# Altium project picoep.PrjPcb
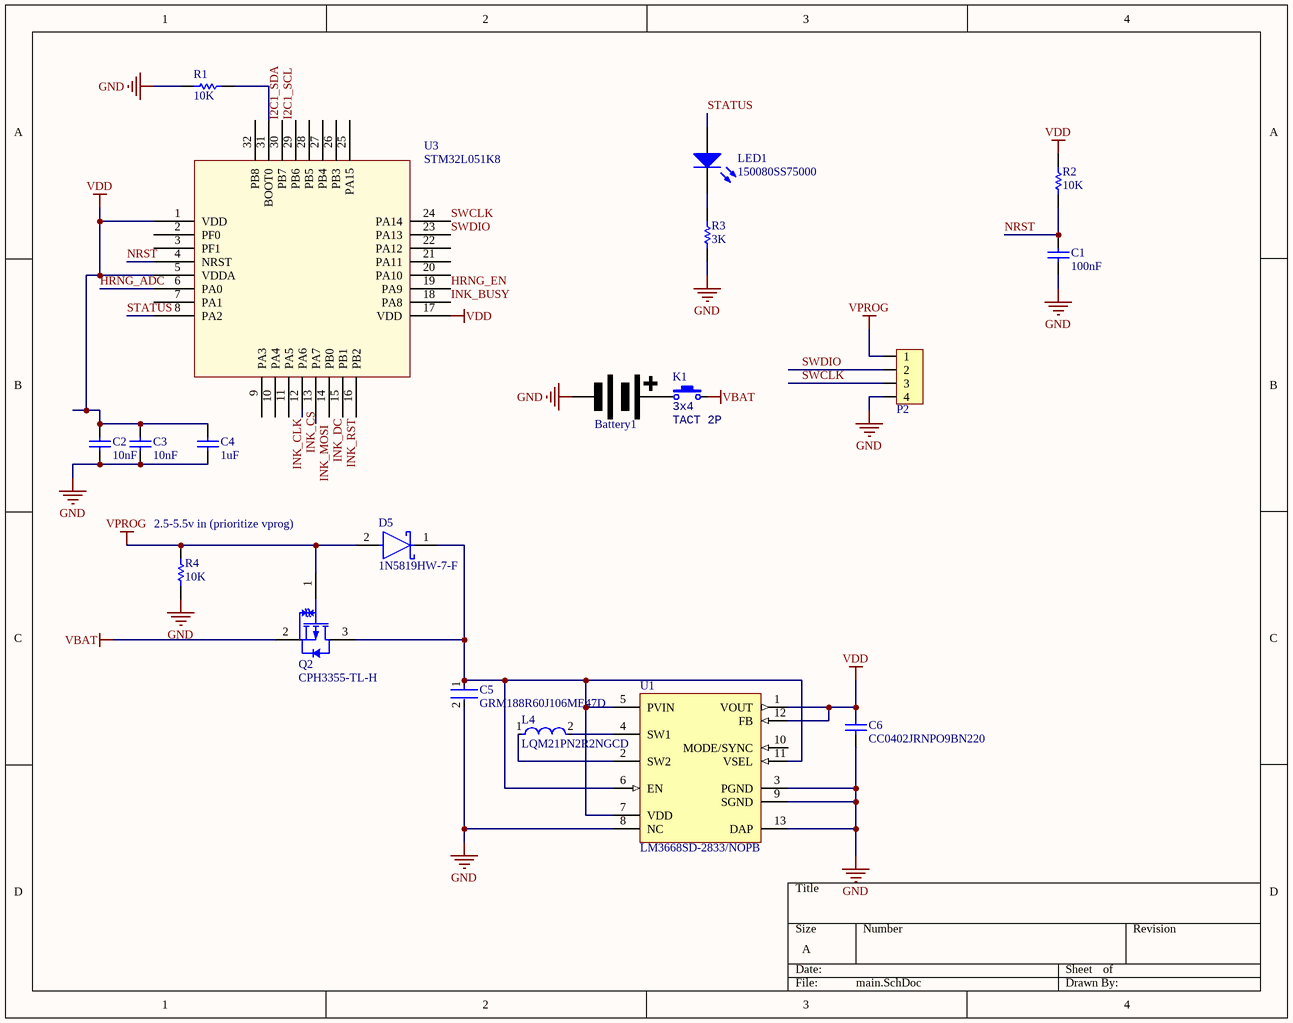
[diagram p0: main.SchDoc]
3 sheets, 54 parts. Net scope: global (net labels, ports and power ports of the same name join across sheets).
Board file: main.PcbDoc
Sheets:
  main.SchDoc
  hrng.SchDoc
  epd.SchDoc

## Sheet main.SchDoc
size A; SheetNumber: 1; SheetTotal: 3

### Parts
Battery1  Battery  [CR2032-1]  (value not drawn)
C1  value 100nF  [C0402]  (hidden comment: Capacitor)
C2  value 10nF  [C0402]  (hidden comment: Capacitor)
C3  value 10nF  [C0402]  (hidden comment: Capacitor)
C4  value 1uF  [C0402]  (hidden comment: MCD-00095)
C5  GRM188R60J106ME47D  [FP-GRM188-0_1-e0_2_0_55-IPC_A]
C6  CC0402JRNPO9BN220  [CAPC1005X55X25ML05T05]
D5  1N5819HW-7-F  [FP-SOD123-IPC_A]
K1  value 3x4  [ButtonTACT_3x4x2_180H]  (hidden comment: TACT 2P)
L4  LQM21PN2R2NGCD  [FP-LQM21PH_G0-IPC_C]
LED1  150080SS75000  [0805_A]
P2  HDR1x4_2.0  [HDR 4_2]  (value not drawn)
Q2  CPH3355-TL-H  [ONSC-CPH-3_V]
R1  value 10K  [R0402]  (hidden comment: Resistor)
R2  value 10K  [R0402]  (hidden comment: Resistor)
R3  value 3K  [R0402]  (hidden comment: MCD-00185)
R4  value 10K  [R0402]  (hidden comment: Resistor)
U1  LM3668SD-2833/NOPB  [DQB0012A_V]
U3  STM32L051K8  [QFN-32]

### Nets
GND: Battery1.1(-) C1.1 C2.1 C3.1 C4.1 C5.2 C6.1 P2.4 R1.2 R3.1 R4.1 U1.3(PGND) U1.8(NC) U1.9(SGND) U1.13(DAP)
VBAT: K1.2 Q2.2(S)
VDD: C2.2 C3.2 C4.2 C6.2 R2.2 U1.1(VOUT) U1.12(FB) U3.1(VDD) U3.5(VDDA) U3.17(VDD)
VPROG: D5.2(A) P2.1 Q2.1(G) R4.2
HRNG_ADC: U3.6(PA0)
HRNG_EN: U3.19(PA9)
I2C1_SCL: U3.29(PB6)
I2C1_SDA: U3.30(PB7)
INK_BUSY: U3.18(PA8)
INK_CLK: U3.11(PA5)
INK_CS: U3.12(PA6)
INK_DC: U3.14(PB0)
INK_MOSI: U3.13(PA7)
INK_RST: U3.15(PB1)
NRST: C1.2 R2.1 U3.4(NRST)
STATUS: LED1.2(A) U3.8(PA2)
SWCLK: P2.3 U3.24(PA14)
SWDIO: P2.2 U3.23(PA13)
NetBattery1_2: Battery1.2(+) K1.1
NetC5_1: C5.1 D5.1(C) Q2.3(D) U1.5(PVIN) U1.6(EN) U1.7(VDD) U1.11(VSEL)
NetL4_1: L4.1 U1.2(SW2)
NetL4_2: L4.2 U1.4(SW1)
NetLED1_1: LED1.1(K) R3.2
NetR1_1: R1.1 U3.31(BOOT0)

Not connected (* = marked no-connect by the designer): U1 10(MODE/SYNC); U3 2(PF0) 3(PF1) 7(PA1) 9(PA3) 10(PA4) 16(PB2) 20(PA10) 21(PA11) 22(PA12) 25(PA15) 26(PB3) 27(PB4) 28(PB5) 32(PB8)

### Notes on the sheet
- (near R4) 2.5-5.5v in (prioritize vprog)

### Library data of the parts
C1 = MCD-00102: Capacitor, MLCC, 100nF, 16V, X7R, 10%, 0402, T=0,5mm; Manufacturer_Part_Number: CC0402KRX7R7BB104; Manufacturer: YAGEO; Alternate_Manufacturer: MURATA; Alternate_Manufacturer_Part_Number: GCM155R71C104KA55D; Provided_By: SUBCO; Initial_Board_Reference: MB1262; Internal_Part_Number: MCD-00102; ComponentLink1Description: Datasheet; Status: Released; Part_Type: Capacitor; Package: C0402; ECCN_US: n/a; ECCN_EU: n/a; ComponentLink1URL: http://tunmcdsvn.tun.st.com/Component_Datasheet_Library/Trunk/Capacitors/Yageo_Multilayer_Capacitor_X7R_series_100pF_to_22uF
C2 C3 = MCD-00011: Capacitor, MLCC, 10nF, 16V, X7R, 10%, 0402, T=0.5mm; Manufacturer_Part_Number: CC0402KRX7R7BB103; Manufacturer: YAGEO; Provided_By: SUBCO; Initial_Board_Reference: MB1274; Internal_Part_Number: MCD-00011; Status: Released; Part_Type: Capacitor; Package: C0402; ComponentLink1Description: Datasheet; ComponentLink1URL: http://tunmcdsvn.tun.st.com/Component_Datasheet_Library/Trunk/Capacitors/Yageo_Multilayer_Capacitor_X7R_series_100pF_to_22uF; ECCN_US: n/a; ECCN_EU: n/a
C4 = MCD-00095: Capacitor,1uF,6V3,X5R,10%,0402; Manufacturer_Part_Number: GRM155R61E105KA12; Manufacturer: MURATA; Alternate_Manufacturer_Part_Number: GRM155R60J105KE19; ECCN_US: EAR99; ECCN_EU: NEC; Provided_By: SUBCO; Initial_Board_Reference: MB1262; Internal_Part_Number: MCD-00095; Status: Released; Part_Type: Capacitor; Package: C0402; ComponentLink1Description: Datasheet; ComponentLink1URL: http://tunmcdsvn.tun.st.com/Component_Datasheet_Library/Trunk/Capacitors/Murata_Capacitor_GR_series; Alternate_Manufacturer: MURATA
C5 = CMP-2006-02792-2: Chip Multilayer Ceramic Capacitors for General Purpose, 0603, 10uF, X5R, 15%, 20%, 6.3V; Packaging: Tape and Reel; Voltage Rating (DC): 6.3V; Width: 0.031inch; Termination: SMD/SMT; Dielectric: X5R; Package Quantity: 4000; Voltage Rating: 6.3V; Capacitance: 10uF; Case/Package: 0603; Min Operating Temperature: -55°C; Voltage: 6.3V; Length: 1.6mm; Thickness: 0.035inch; Lead Free: Lead Free; Depth: 0.8mm; Case Code (Imperial): 0603; Max Operating Temperature: 85°C; Material: Ceramic; Height: 0.8mm; Tolerance: 20%; Mount: Surface Mount; REACH SVHC: No SVHC; Radiation Hardening: No; Case Code (Metric): 1608
C6 = CMP-2100-03590-1: Chip Capacitor, 22 pF, +/- 5%, 50 V, -55 to 125 degC, 0402 (1005 Metric), RoHS, Tape and Reel; Manufacturer: Yageo; Voltage Rating: 50V; Dielectric Material: Ceramic; Capacitance: 22pF; Temperature Coefficient: 30ppm/degC; Dielectric: C0G; Insulation Resistance: 100GR; Datasheet URL: http://www.yageo.com/NewPortal/yageodocoutput?fileName=/pdf/MLCC/UPY-GP_NP0_16V-to-50V_14.pdf; Depth: 0.5mm; Number of Pins: 2; Height: 0.5mm; Min Operating Temperature: -55degC; REACH SVHC: NoSVHC; Max Operating Temperature: 125degC; Voltage Rating (DC): 50V; Composition: Ceramic; Packaging: TapeandReel; Package Quantity: 1; Package Reference: 0402; Length: 1mm; Radiation Hardening: No; Package Description: 2-Pin Surface Mount Device, Body 1 x 0.5 mm; RoHSCompliant: True; Thickness: 0.022inch; Manufacturer URL: http://www.yageo.com/; Mount: SurfaceMount; Case Code (Metric): 1005; Case/Package: 0402; Tolerance: 5%; Termination: SMD/SMT; Width: 0.02inch; Datasheet Version: Rev. 14, 07/2016; Lead Free: LeadFree; Case Code (Imperial): 0402
D5 = CMP-0303-00003-3: DIODE SCHOTTKY 40V 1A SOD123; Forward Voltage: 450mV; Capacitance: 110pF; Max Forward Surge Current (Ifsm): 25A; Peak Reverse Current: 50uA; Polarity: Standard; Element Configuration: Single; Max Power Dissipation: 450mW; Min Operating Temperature: -65°C; Package Quantity: 3000; Contact Plating: Tin; Weight: 0.000353oz; Max Repetitive Reverse Voltage (Vrrm): 40V; Max Reverse Voltage (DC): 40V; Height: 1.25mm; Average Rectified Current: 1A; Width: 1.7mm; Case/Package: SOD-123-2; Lead Free: Lead Free; Max Operating Temperature: 125°C; Current Rating: 1A; Termination: SMD/SMT; Forward Current: 1A; Radiation Hardening: No; Number of Pins: 2; Length: 2.85mm; Voltage Rating (DC): 40V; REACH SVHC: No SVHC; Peak Non-Repetitive Surge Current: 25A; Packaging: Tape and Reel; Output Current: 1A
K1 = ButtonTACT_3x4x2_180: Button; type: TACT 2P
L4 = CMP-06042-016317-1: Multilayer Type Inductor for Power Lines, 0805 (2012), 2.2μH, 30%, 0.288Ω, 0.8A; Test Frequency: 1MHz; Shielding: Shielded; Current Rating: 800mA; Self Resonant Frequency: 40MHz; Core Material: Ferrite; Inductance: 2.2uH; DC Resistance (DCR): 288mR; RoHS Compliant: Yes; REACH SVHC: No SVHC; Inductance Tolerance: 30%; Package Quantity: 4000; Military Standard: Not; Max Operating Temperature: 125°C; Radiation Hardening: No; Series: LQM; Height - Seated (Max): 0.039inch; Tolerance: 30%; Height: 0.9mm; Lead Free: Lead Free; Case Code (Metric): 2012; Packaging: Tape and Reel; Termination: SMD/SMT; Case Code (Imperial): 0805; Min Operating Temperature: -55°C; Depth: 1.4mm; Mount: Surface Mount; Length: 2mm; DC Current: 800mA; Case/Package: 0805; Max DC Current: 800mA; Width: 0.049inch
LED1 = CMP-1426-00010-1: SMD mono-color Chip LED, WL-SMCW, Super Red; Manufacturer: Wuerth Elektronik; PackageReference: 0805_A; ComponentLink2URL: http://katalog.we-online.com/led/datasheet/150080SS75000.pdf; ComponentLink1URL: http://www.we-online.com; Color: Super Red; ComponentLink2Description: Datasheet; ComponentLink1Description: Manufacturer URL; PartNumber: 150080SS75000
Q2 = CMP-1058-00068-1: P-Channel Power MOSFET, -30 V, -2.5 A, 156 mOhm, 3-Pin CPH, Pb-Free, Tape and Reel; Manufacturer: On Semiconductor; Channel Polarity: P Channel; Configuration: Single; PD Max (W): 1; VGS(th) Max (V): 2.6; VGS Max (V): 20; ID Max (A): 2.5; Ciss Typ (pF): 172; Crss Typ (pF): 36; V(BR)DSS Min (V): 30; Coss Typ (pF): 51; PackageDescription: 3-Pin Small Outline Transistor, Body 2.9 x 1.6 mm, Pitch 0.95 mm; Mounting Technology: Surface Mount; ComponentLink2URL: http://www.onsemi.com/pub_link/Collateral/CPH3355-D.PDF; PackageReference: CPH-3; Package Type: CPH-3; ComponentLink2Description: Datasheet; ComponentLink1Description: Manufacturer URL; PartNumber: CPH3355-TL-H; RoHS: Pb-Free; Packing: Tape and Reel; ComponentLink3URL: http://www.onsemi.com/pub_link/Collateral/50A02CH-D.PDF; ComponentLink1URL: http://www.onsemi.com/; ComponentLink3Description: Package Specification
R1 R2 R4 = MCD-00053: Resistor,10K,0402,1%,1/16W; Manufacturer_Part_Number: RC0402FR-0710KL; Manufacturer: YAGEO; Provided_By: SUBCO; Initial_Board_Reference: MB1274; Internal_Part_Number: MCD-00053; ComponentLink1Description: Datasheet; ECCN_US: n/a; ECCN_EU: n/a; Status: Released; Part_Type: Resistor; ComponentLink1URL: http://tunmcdsvn.tun.st.com/Component_Datasheet_Library/Trunk/Resistors/Yageo_Resistor_RC0402-series; Package: R0402
R3 = MCD-00185: Resistor,3K,0402,1%,1/16W; Manufacturer_Part_Number: RC0402FR-073KL; Manufacturer: YAGEO; Provided_By: SUBCO; Internal_Part_Number: MCD-00185; Status: Released; Part_Type: Resistor; ComponentLink1Description: Datasheet; ECCN_US: n/a; ECCN_EU: n/a; ComponentLink1URL: http://tunmcdsvn.tun.st.com/Component_Datasheet_Library/Trunk/Resistors/Yageo_Resistor_RC0402-series; Package: R0402
U1 = CMP-0063-00665-3: 1A, High Efficiency Dual Mode Single Inductor Buck-Boost DC/DC Converter, 12-pin LLP, Pb-Free; Manufacturer: Texas Instruments; PowerWise: Y; CompType: MiscPower; PackageTopMarking: ZXYTT*S017B; ComponentLink1URL: http://www.ti.com/general/docs/lit/getliterature.tsp?genericPartNumber=LM3668&fileType=pdf; ComponentLink1Description: Datasheet URL; PackageReference: DQB0012A; PinCount: 12; RoHS: Y; PackageDescription: LLP, Plastic, Dual, 3 x 3 x 0.8mm Body, 12 Lead, 0.4mm Pitch, No Pullback

## Sheet hrng.SchDoc
size A; SheetNumber: 2; SheetTotal: 3
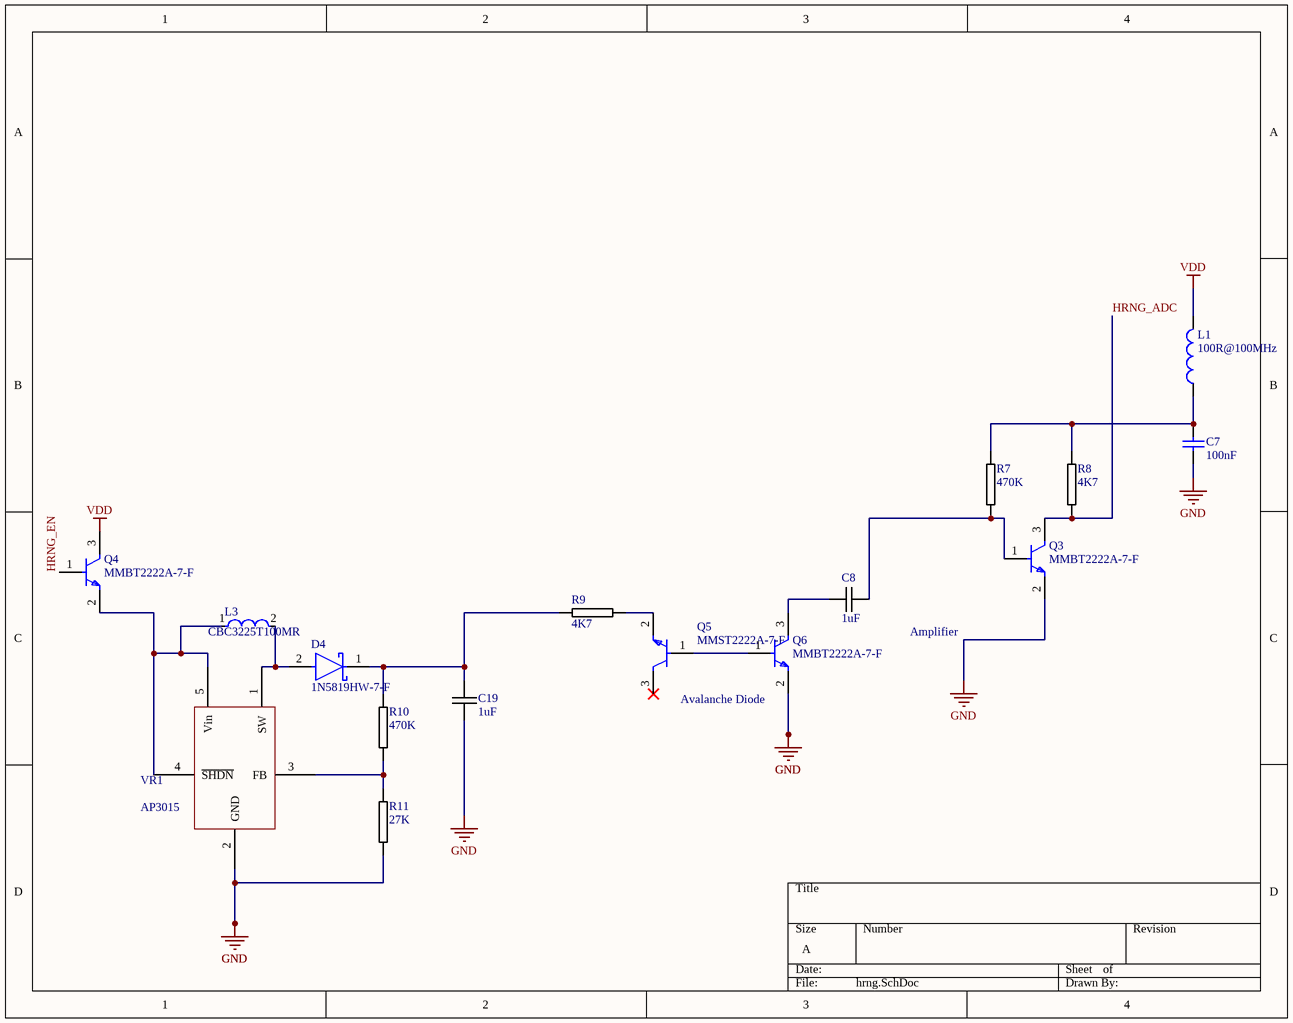
[diagram p1: hrng.SchDoc]

### Parts
C7  value 100nF  [C0402]  (hidden comment: Capacitor)
C8  1uF  [0402C-GENERIC]
C19  1uF  [0402C-GENERIC]
D4  1N5819HW-7-F  [FP-SOD123-IPC_A]
L1  value 100R@100MHz  [FIL_0603_H0P65]  (hidden comment: MCD-00094)
L3  CBC3225T100MR  [FP-CB3225-IPC_A]
Q3  MMBT2222A-7-F  [FP-SOT23-IPC_A]
Q4  MMBT2222A-7-F  [FP-SOT23-IPC_A]
Q5  MMST2222A-7-F  [FP-SOT23-IPC_A]
Q6  MMBT2222A-7-F  [FP-SOT23-IPC_A]
R7  470K  [0603R-470K]
R8  4K7  [0603R-4K7]
R9  4K7  [0603R-4K7]
R10  470K  [0603R-470K]
R11  27K  [0603R-27K]
VR1  AP3015  [SOT23-5]

### Nets
GND: C7.1 C19.2 Q3.2(E) Q6.2(E) R11.2 VR1.2(GND)
VDD: L1.2 Q4.3(C)
HRNG_ADC: Q3.3(C) R8.1
HRNG_EN: Q4.1(B)
NetC7_2: C7.2 L1.1 R7.1 R8.2
NetC8_1: C8.1 Q6.3(C)
NetC8_2: C8.2 Q3.1(B) R7.2
NetC19_1: C19.1 D4.1(C) R9.1 R10.1
NetD4_2: D4.2(A) L3.2 VR1.1(SW)
NetL3_1: L3.1 Q4.2(E) VR1.4(~{SHDN}) VR1.5(Vin)
NetQ5_1: Q5.1(B) Q6.1(B)
NetQ5_2: Q5.2(E) R9.2
NetR10_2: R10.2 R11.1 VR1.3(FB)

Not connected (* = marked no-connect by the designer): Q5 3(C)*

### Notes on the sheet
- Amplifier
- Avalanche Diode

### Library data of the parts
C7 = MCD-00102: as C1 on sheet main; Internal_Part_Number: MCD-00102; ComponentLink1Description: Datasheet; Status: Released; Part_Type: Capacitor; Package: C0402; ECCN_US: n/a; ECCN_EU: n/a; ComponentLink1URL: http://tunmcdsvn.tun.st.com/Component_Datasheet_Library/Trunk/Capacitors/Yageo_Multilayer_Capacitor_X7R_series_100pF_to_22uF
C8 C19 = 0402C-1UF-25V-X5R-SAM: CAPACITOR 0402 CERAMIC; Reel: C49
D4 = CMP-0303-00003-3: as D5 on sheet main; Min Operating Temperature: -65°C; Package Quantity: 3000; Contact Plating: Tin; Weight: 0.000353oz; Max Repetitive Reverse Voltage (Vrrm): 40V; Max Reverse Voltage (DC): 40V; Height: 1.25mm; Average Rectified Current: 1A; Width: 1.7mm; Case/Package: SOD-123-2; Lead Free: Lead Free; Max Operating Temperature: 125°C; Current Rating: 1A; Termination: SMD/SMT; Forward Current: 1A; Radiation Hardening: No; Number of Pins: 2; Length: 2.85mm; Voltage Rating (DC): 40V; REACH SVHC: No SVHC; Peak Non-Repetitive Surge Current: 25A; Packaging: Tape and Reel; Output Current: 1A
L1 = MCD-00094: Ferrite bead 100R 2A 0603; Manufacturer_Part_Number: BLM18EG101TN1; Manufacturer: MURATA; Part_Type: Inductor; ECCN_US: EAR99; ECCN_EU: NEC; Provided_By: SUBCO; Initial_Board_Reference: mb1262; Internal_Part_Number: MCD-00094; ComponentLink1Description: Datasheet; Status: Released; ComponentLink1URL: http://tunmcdsvn.tun.st.com/Component_Datasheet_Library/Trunk/Inductors/Murata_EMI_Filters_BLM
L3 = CMP-14484-000123-1: SMD Inductors 10uH ±20% 0.9A 0.1729Ω 1210; Shielding: Unshielded; DC Resistance (DCR): 172.9mR; Core Material: Ferrite; Self Resonant Frequency: 23MHz; Max DC Current: 900mA; Test Frequency: 100kHz; Package Quantity: 1000; Military Standard: Not; Inductance: 10uH; Height: 2.5mm; Case Code (Metric): 3225; Width: 0.098inch; Case Code (Imperial): 1210; Inductance Tolerance: 20%; Lead Free: Lead Free; Length: 3.4mm; Max Operating Temperature: 105°C; Resistor Type: Wirewound; Height - Seated (Max): 0.106inch; Series: CB; Packaging: Tape and Reel; Depth: 2.7mm; Number of Pins: 2; Radiation Hardening: No; Tolerance: 20%; Case/Package: 1210; Mount: Surface Mount; Saturation Current: 900mA; Min Operating Temperature: -40°C; DC Current: 900mA; Current Rating: 900mA; Halogen Free: Halogen Free; Termination: SMD/SMT
Q3-Q6 = CMP-1693-00003-4: TRANS NPN 40V 0.6A SMD SOT23-3; Number of Elements: 1; Frequency: 300MHz; Max Collector Current: 600mA; Collector Base Voltage (VCBO): 75V; Current: 1A; Element Configuration: Single; Power Dissipation: 350mW; hFE Min: 100; Collector Emitter Saturation Voltage: 1V; Max Power Dissipation: 300mW; Emitter Base Voltage (VEBO): 6V; Voltage: 40V; Collector Emitter Breakdown Voltage: 40V; Width: 1.4mm; Polarity: NPN; Termination: SMD/SMT; Max Operating Temperature: 150°C; Transition Frequency: 300MHz; Contact Plating: Tin; Mount: Surface Mount; Max Frequency: 300MHz; Case/Package: SOT-23; Gain Bandwidth Product: 300MHz; Lead Free: Lead Free; Collector Emitter Voltage (VCEO): 40V; Radiation Hardening: No; Voltage Rating (DC): 40V; Height: 1mm; Max Breakdown Voltage: 40V; Packaging: Tape and Reel; Length: 3.05mm; Min Operating Temperature: -55°C; Weight: 0.000282oz; Current Rating: 600mA; REACH SVHC: No SVHC; Package Quantity: 3000; Continuous Collector Current: 600mA; Number of Pins: 3
R7 R10 = 0603R-470K: GENERIC RESISTOR 0603; Manufacturer Part Number: RMCF 1/16 470K 1% R; Manufacturer: Stackpole Electronics Inc; Temperature Coefficient: ±100ppm/°C; Tolerance: ±1%; Power (Watts): 0.1W, 1/10W; Supplier 1: Digi-Key; Supplier Part Number 1: RMCF1/16470KFRCT-ND; Supplier Part Number: RMCF1/16470KFRCT-ND; Composition: Thick Film; Category: Resistors; Lead Style: Surface Mount (SMD - SMT); RoHS: RoHS Compliant; Resistance In Ohms: 470K; Case: 0603 (1608 metric); Supplier: Digi-Key; Packaging: Cut Tape (CT)
R8 R9 = 0603R-4K7: GENERIC RESISTOR 0603; Manufacturer: Stackpole Electronics Inc; Manufacturer Part Number: RMCF 1/16 4.7K 1% R; Reel: R23; Supplier 1: Digi-Key; Supplier Part Number 1: RMCF0603FT4K70TR-ND
R11 = 0603R-27K: GENERIC RESISTOR 0603; Manufacturer: Stackpole Electronics Inc; Manufacturer Part Number: RMC 1/16 27K 1% R; Resistance In Ohms: 27.0K; Temperature Coefficient: ±100ppm/°C; Tolerance: ±1%; Power (Watts): 0.1W, 1/10W; Supplier 1: Digi-Key; Supplier Part Number 1: RMC1/1627KFR-ND; Case: 0603 (1608 metric); Supplier: Digi-Key; Packaging: Tape & Reel (TR); RoHS: RoHS Compliant; Category: Resistors; Composition: Thick Film; Supplier Part Number: RMC1/1627KFR-ND; Lead Style: Surface Mount (SMD - SMT)
VR1 = LT1930A

## Sheet epd.SchDoc
size A; SheetNumber: 3; SheetTotal: 3
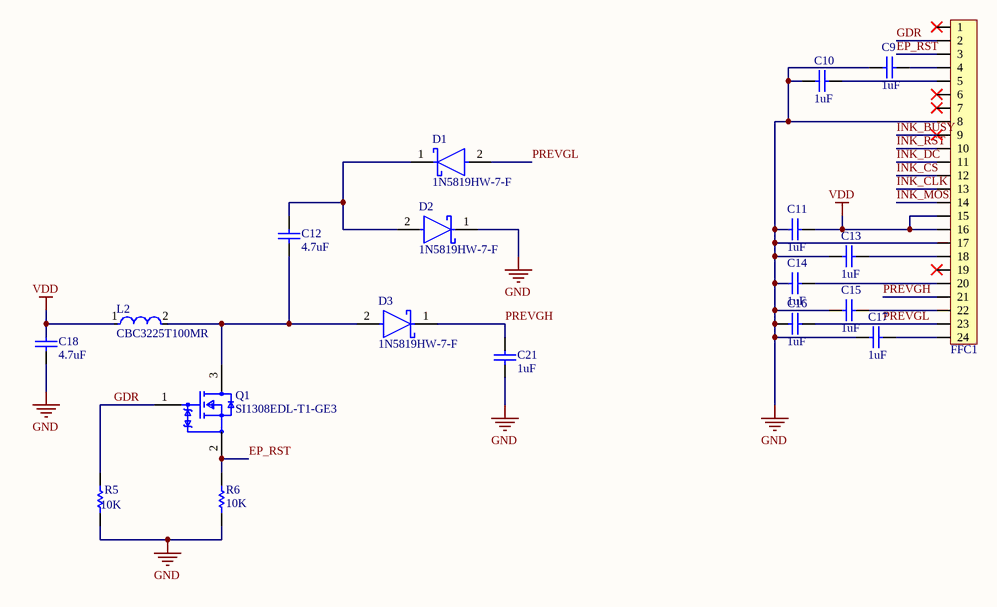
[diagram p2: epd.SchDoc]

### Parts
C9  value 1uF  [C0402]  (hidden comment: MCD-00095)
C10  value 1uF  [C0402]  (hidden comment: MCD-00095)
C11  value 1uF  [C0402]  (hidden comment: MCD-00095)
C12  value 4.7uF  [C0402]  (hidden comment: Capacitor)
C13  value 1uF  [C0402]  (hidden comment: MCD-00095)
C14  value 1uF  [C0402]  (hidden comment: MCD-00095)
C15  value 1uF  [C0402]  (hidden comment: MCD-00095)
C16  value 1uF  [C0402]  (hidden comment: MCD-00095)
C17  value 1uF  [C0402]  (hidden comment: MCD-00095)
C18  value 4.7uF  [C0402]  (hidden comment: Capacitor)
C21  value 1uF  [C0402]  (hidden comment: MCD-00095)
D1  1N5819HW-7-F  [FP-SOD123-IPC_A]
D2  1N5819HW-7-F  [FP-SOD123-IPC_A]
D3  1N5819HW-7-F  [FP-SOD123-IPC_A]
FFC1  FFC_0.5_24  [FFC_0.5_24_INK]  (value not drawn)
L2  CBC3225T100MR  [FP-CB3225-IPC_A]
Q1  SI1308EDL-T1-GE3  [FP-5549-MFG]
R5  value 10K  [R0402]  (hidden comment: Resistor)
R6  value 10K  [R0402]  (hidden comment: Resistor)

### Nets
GND: C9.1 C10.1 C11.1 C13.1 C14.1 C15.1 C16.1 C17.1 C18.1 C21.1 D2.1(C) FFC1.8 FFC1.17 R5.1 R6.1
VDD: C11.2 C18.2 FFC1.15 FFC1.16 L2.1
EP_RST: FFC1.3 Q1.2(S) R6.2
GDR: FFC1.2 Q1.1(G) R5.2
INK_BUSY: FFC1.9
INK_CLK: FFC1.13
INK_CS: FFC1.12
INK_DC: FFC1.11
INK_MOSI: FFC1.14
INK_RST: FFC1.10
PREVGH: C21.2 D3.1(C) FFC1.21
PREVGL: C16.2 D1.2(A) FFC1.23
NetC9_2: C9.2 FFC1.4
NetC10_2: C10.2 FFC1.5
NetC12_1: C12.1 D3.2(A) L2.2 Q1.3(D)
NetC12_2: C12.2 D1.1(C) D2.2(A)
NetC13_2: C13.2 FFC1.18
NetC14_2: C14.2 FFC1.20
NetC15_2: C15.2 FFC1.22
NetC17_2: C17.2 FFC1.24

Not connected (* = marked no-connect by the designer): FFC1 1* 6* 7* 19*

### Library data of the parts
C9-C11 C13-C17 C21 = MCD-00095: as C4 on sheet main; Internal_Part_Number: MCD-00095; Status: Released; Part_Type: Capacitor; Package: C0402; ComponentLink1Description: Datasheet; ComponentLink1URL: http://tunmcdsvn.tun.st.com/Component_Datasheet_Library/Trunk/Capacitors/Murata_Capacitor_GR_series; Alternate_Manufacturer: MURATA
C12 C18 = MCD-01356: Capacitor, MLCC, 4.7uF, 6V3, X5R, 20%, 0402, T=0,5mm; Manufacturer_Part_Number: GRM155R60J475ME47; Manufacturer: MURATA; Provided_By: SUBCO; Internal_Part_Number: MCD-01356; Status: Released; Part_Type: Capacitor; Package: C0402; ComponentLink1Description: Datasheet; ComponentLink1URL: http://tunmcdsvn.tun.st.com/Component_Datasheet_Library/Trunk/Capacitors/Murata_Capacitor_GR_series
D1-D3 = CMP-0303-00003-3: as D5 on sheet main; Min Operating Temperature: -65°C; Package Quantity: 3000; Contact Plating: Tin; Weight: 0.000353oz; Max Repetitive Reverse Voltage (Vrrm): 40V; Max Reverse Voltage (DC): 40V; Height: 1.25mm; Average Rectified Current: 1A; Width: 1.7mm; Case/Package: SOD-123-2; Lead Free: Lead Free; Max Operating Temperature: 125°C; Current Rating: 1A; Termination: SMD/SMT; Forward Current: 1A; Radiation Hardening: No; Number of Pins: 2; Length: 2.85mm; Voltage Rating (DC): 40V; REACH SVHC: No SVHC; Peak Non-Repetitive Surge Current: 25A; Packaging: Tape and Reel; Output Current: 1A
FFC1 = FFC_0.5_24_INK: FFC
L2 = CMP-14484-000123-1: as L3 on sheet hrng; Package Quantity: 1000; Military Standard: Not; Inductance: 10uH; Height: 2.5mm; Case Code (Metric): 3225; Width: 0.098inch; Case Code (Imperial): 1210; Inductance Tolerance: 20%; Lead Free: Lead Free; Length: 3.4mm; Max Operating Temperature: 105°C; Resistor Type: Wirewound; Height - Seated (Max): 0.106inch; Series: CB; Packaging: Tape and Reel; Depth: 2.7mm; Number of Pins: 2; Radiation Hardening: No; Tolerance: 20%; Case/Package: 1210; Mount: Surface Mount; Saturation Current: 900mA; Min Operating Temperature: -40°C; DC Current: 900mA; Current Rating: 900mA; Halogen Free: Halogen Free; Termination: SMD/SMT
Q1 = CMP-02550-000099-2: MOSFET N-CH 30V 1.4A SC-70-3; Fall Time: 8ns; Max Power Dissipation: 500mW; Rise Time: 9ns; Rds On Max: 132mR; Power Dissipation: 400mW; Polarity: N-CHANNEL; Number of Elements: 1; Element Configuration: Single; Threshold Voltage: 600mV; Continuous Drain Current (ID): 1.5A; Gate to Source Voltage (Vgs): 12V; Turn-On Delay Time: 2ns; Input Capacitance: 105pF; Package Quantity: 3000; REACH SVHC: No SVHC; Mount: Surface Mount; Packaging: Tape and Reel; On-State Resistance: 132mR; Drain-source On Resistance-Max: 132mR; Lead Free: Lead Free; Drain to Source Breakdown Voltage: 30V; Series: TrenchFET®; Max Operating Temperature: 150°C; Drain to Source Resistance: 132mR; Radiation Hardening: No; Length: 2.2mm; Min Operating Temperature: -55°C; Number of Channels: 1; Drain to Source Voltage (Vdss): 30V; Number of Pins: 3; Turn-Off Delay Time: 8ns; Weight: 0.004395oz; RoHS Compliant: Yes; Width: 1.35mm; Height: 1mm; Case/Package: SOT-323
R5 R6 = MCD-00053: as R1 on sheet main; Internal_Part_Number: MCD-00053; ComponentLink1Description: Datasheet; ECCN_US: n/a; ECCN_EU: n/a; Status: Released; Part_Type: Resistor; ComponentLink1URL: http://tunmcdsvn.tun.st.com/Component_Datasheet_Library/Trunk/Resistors/Yageo_Resistor_RC0402-series; Package: R0402

## Nets that join several sheets
GND: main (15 pins), hrng (6 pins), epd (15 pins)
VDD: main (10 pins), hrng (L1.2 Q4.3), epd (5 pins)
HRNG_ADC: main (U3.6), hrng (Q3.3 R8.1)
HRNG_EN: main (U3.19), hrng (Q4.1)
INK_BUSY: main (U3.18), epd (FFC1.9)
INK_CLK: main (U3.11), epd (FFC1.13)
INK_CS: main (U3.12), epd (FFC1.12)
INK_DC: main (U3.14), epd (FFC1.11)
INK_MOSI: main (U3.13), epd (FFC1.14)
INK_RST: main (U3.15), epd (FFC1.10)